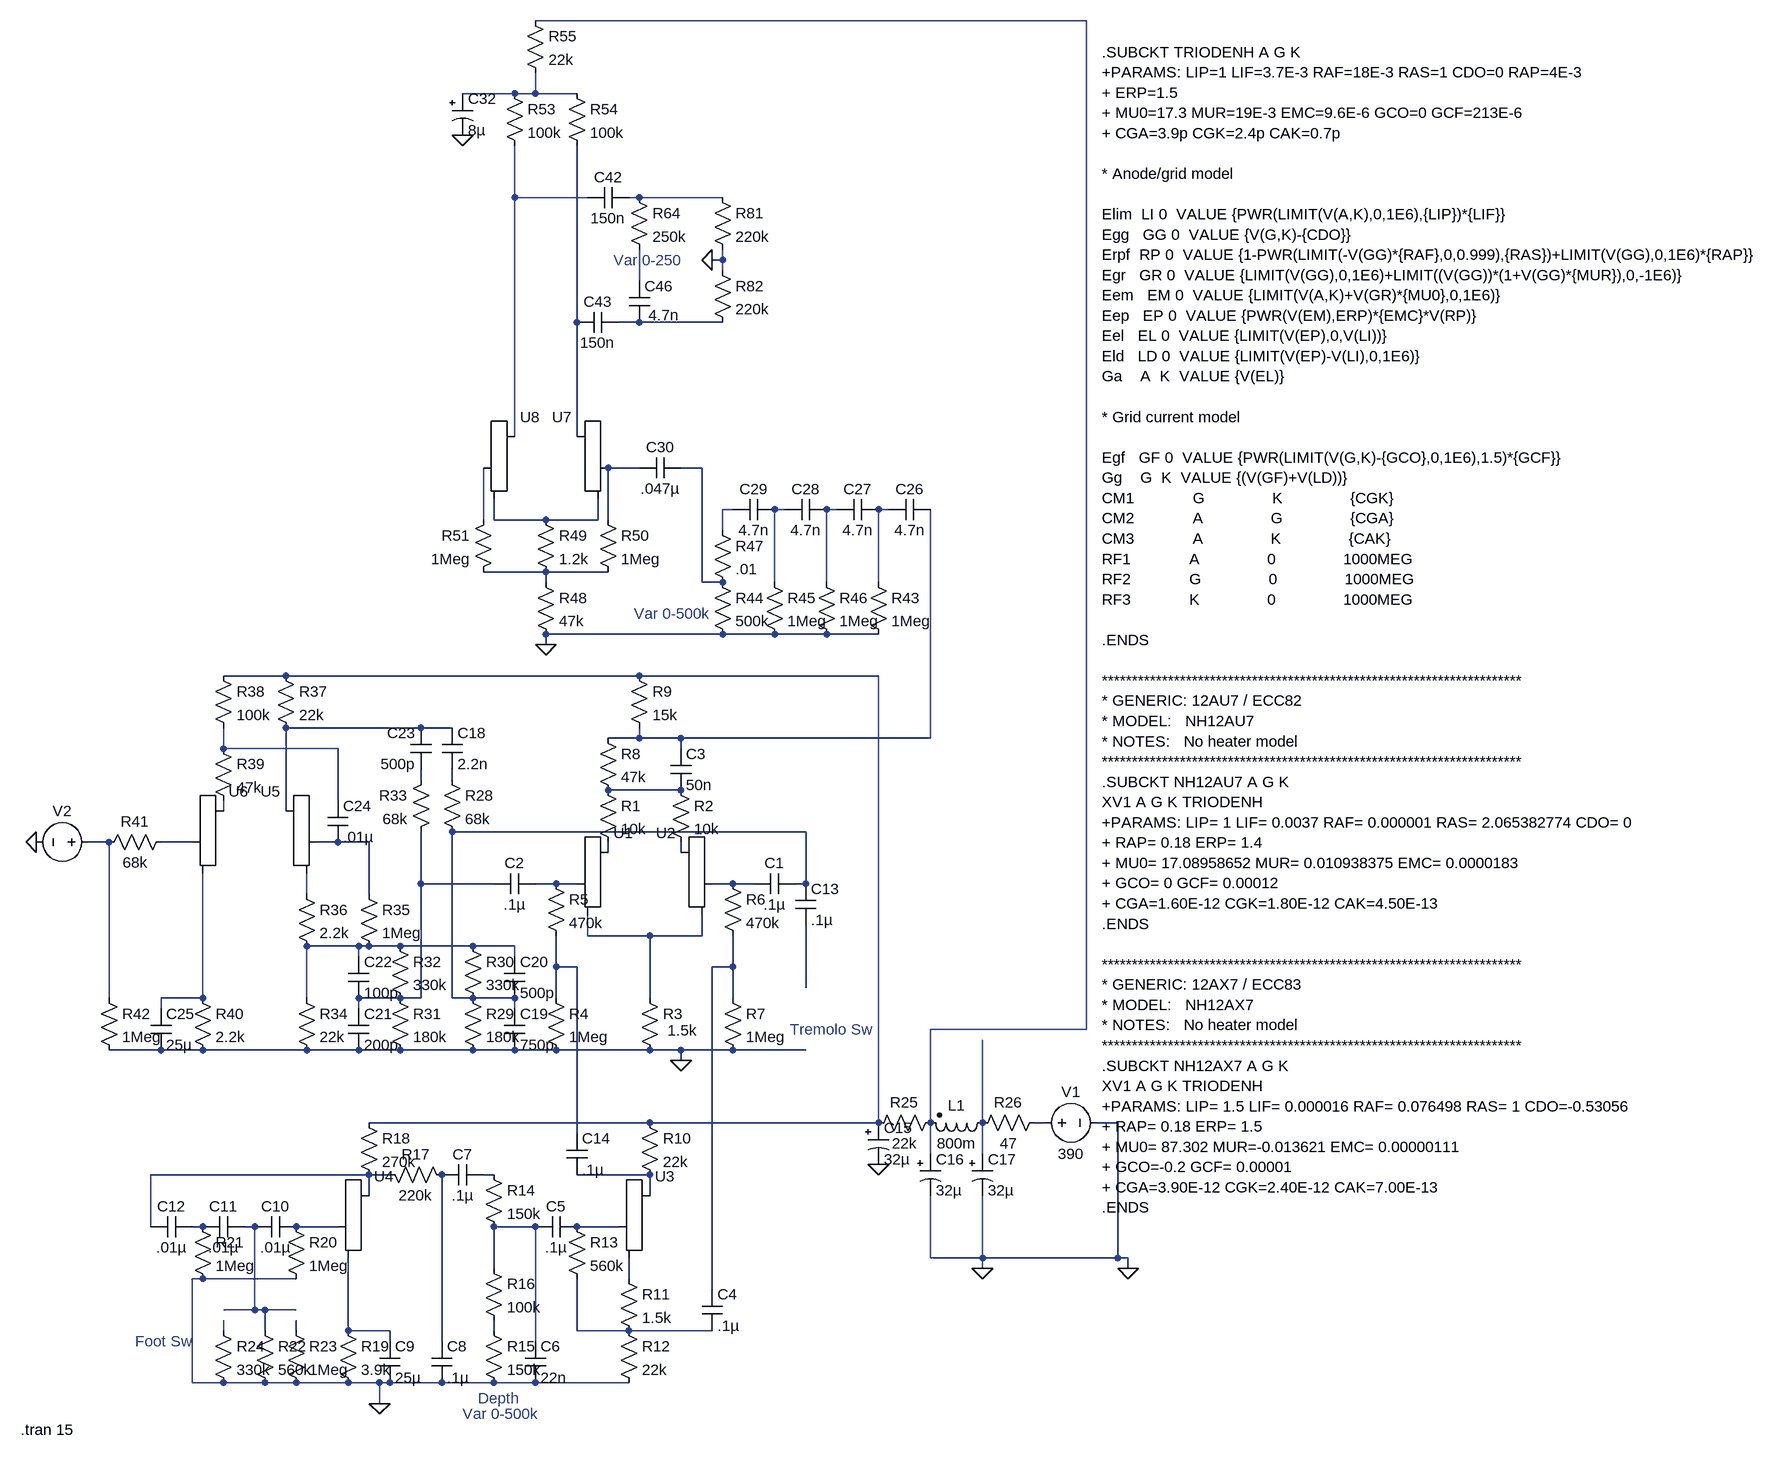
[diagram p0: schematic partial.asc]
partial.asc, the LTspice schematic file:
Version 4
SHEET 1 3184 12068
WIRE 912 -1440 64 -1440
WIRE 32 -1328 -48 -1328
WIRE 64 -1328 64 -1360
WIRE 64 -1328 32 -1328
WIRE 128 -1328 64 -1328
WIRE 32 -1168 32 -1248
WIRE 144 -1168 32 -1168
WIRE 224 -1168 208 -1168
WIRE 352 -1168 224 -1168
WIRE 352 -1072 352 -1088
WIRE 352 -1072 336 -1072
WIRE 352 -1056 352 -1072
WIRE 224 -1040 224 -1088
WIRE 128 -976 128 -1248
WIRE 224 -976 192 -976
WIRE 352 -976 224 -976
WIRE 32 -800 32 -1168
WIRE 128 -800 128 -976
WIRE 224 -752 176 -752
WIRE 320 -752 288 -752
WIRE 368 -688 352 -688
WIRE 448 -688 432 -688
WIRE 528 -688 512 -688
WIRE 608 -688 592 -688
WIRE -16 -672 -16 -752
WIRE 0 -672 0 -704
WIRE 80 -672 0 -672
WIRE 160 -672 160 -704
WIRE 160 -672 80 -672
WIRE 176 -672 176 -752
WIRE 352 -656 352 -688
WIRE 80 -592 -16 -592
WIRE 176 -592 80 -592
WIRE 80 -576 80 -592
WIRE 320 -576 320 -752
WIRE 352 -576 320 -576
WIRE 432 -576 432 -688
WIRE 512 -576 512 -688
WIRE 592 -576 592 -688
WIRE 352 -496 80 -496
WIRE 432 -496 352 -496
WIRE 512 -496 432 -496
WIRE 592 -496 512 -496
WIRE 80 -480 80 -496
WIRE -320 -432 -416 -432
WIRE 224 -432 -320 -432
WIRE 592 -432 224 -432
WIRE -112 -352 -320 -352
WIRE -64 -352 -112 -352
WIRE 224 -336 224 -352
WIRE 224 -336 176 -336
WIRE 288 -336 224 -336
WIRE 672 -336 672 -688
WIRE 672 -336 288 -336
WIRE -416 -320 -416 -352
WIRE -240 -320 -416 -320
WIRE 288 -320 288 -336
WIRE -112 -272 -112 -288
WIRE -64 -272 -64 -288
WIRE 288 -256 176 -256
WIRE -240 -240 -240 -320
WIRE -416 -224 -416 -240
WIRE -320 -224 -320 -352
WIRE 480 -192 -64 -192
WIRE -592 -176 -624 -176
WIRE -464 -176 -512 -176
WIRE -240 -176 -272 -176
WIRE -192 -176 -240 -176
WIRE 176 -160 176 -176
WIRE 288 -160 288 -176
WIRE -112 -112 -112 -192
WIRE 0 -112 -112 -112
WIRE 96 -112 64 -112
WIRE 128 -112 96 -112
WIRE 368 -112 336 -112
WIRE 400 -112 368 -112
WIRE 480 -112 480 -192
WIRE 480 -112 464 -112
WIRE -288 -96 -288 -128
WIRE -192 -96 -192 -176
WIRE 144 -32 144 -64
WIRE 240 -32 144 -32
WIRE 320 -32 320 -64
WIRE 320 -32 240 -32
WIRE -208 -16 -288 -16
WIRE -192 -16 -208 -16
WIRE -144 -16 -192 -16
WIRE -32 -16 -144 -16
WIRE 32 -16 -32 -16
WIRE -208 0 -208 -16
WIRE 32 0 32 -16
WIRE 96 16 96 -32
WIRE 128 16 96 16
WIRE 368 16 368 -32
WIRE 368 16 336 16
WIRE 480 48 480 -48
WIRE -592 64 -592 -176
WIRE -448 64 -448 -128
WIRE -448 64 -512 64
WIRE -288 64 -288 -16
WIRE -144 64 -208 64
WIRE -112 64 -112 -112
WIRE -112 64 -144 64
WIRE -64 64 -64 -192
WIRE -32 64 -64 64
WIRE 32 64 -32 64
WIRE 96 64 96 16
WIRE 240 64 240 -32
WIRE 368 64 368 16
WIRE -512 80 -512 64
WIRE -208 80 -208 64
WIRE 32 80 32 64
WIRE 912 112 912 -1440
WIRE 912 112 672 112
WIRE -512 144 -592 144
WIRE -448 144 -512 144
WIRE -288 144 -448 144
WIRE -208 144 -288 144
WIRE -144 144 -208 144
WIRE -32 144 -144 144
WIRE 32 144 -32 144
WIRE 96 144 32 144
WIRE 240 144 96 144
WIRE 288 144 240 144
WIRE 368 144 288 144
WIRE 480 144 368 144
WIRE 288 160 288 144
WIRE 240 256 -192 256
WIRE 592 256 592 -432
WIRE 592 256 240 256
WIRE 672 256 672 112
WIRE 752 256 752 128
WIRE 848 256 832 256
WIRE 960 256 928 256
WIRE 128 272 128 16
WIRE 672 304 672 256
WIRE 752 304 752 256
WIRE -192 336 -528 336
WIRE -160 336 -192 336
WIRE 0 336 -16 336
WIRE 240 336 128 336
WIRE -192 368 -192 336
WIRE 240 368 240 336
WIRE -528 416 -528 336
WIRE -448 416 -464 416
WIRE -368 416 -384 416
WIRE -240 416 -304 416
WIRE 64 416 0 416
WIRE 192 416 128 416
WIRE 672 464 672 368
WIRE 752 464 752 368
WIRE 752 464 672 464
WIRE 960 464 960 256
WIRE 960 464 752 464
WIRE 976 464 960 464
WIRE 0 480 0 416
WIRE 752 480 752 464
WIRE 976 480 976 464
WIRE -448 496 -464 496
WIRE -304 496 -448 496
WIRE 208 496 208 464
WIRE 336 512 336 16
WIRE -368 544 -368 416
WIRE -368 544 -416 544
WIRE -352 544 -368 544
WIRE -304 544 -352 544
WIRE -416 576 -416 560
WIRE -352 576 -352 544
WIRE -304 576 -304 560
WIRE -224 576 -224 464
WIRE -160 576 -224 576
WIRE 0 576 0 560
WIRE 128 576 128 496
WIRE 208 576 128 576
WIRE 336 576 208 576
WIRE -160 592 -160 576
WIRE -80 592 -80 336
WIRE 64 592 64 416
WIRE -464 656 -464 496
WIRE -416 656 -464 656
WIRE -352 656 -416 656
WIRE -304 656 -352 656
WIRE -224 656 -304 656
WIRE -176 656 -224 656
WIRE -160 656 -176 656
WIRE -80 656 -160 656
WIRE 0 656 -80 656
WIRE 64 656 0 656
WIRE 208 656 64 656
WIRE -176 688 -176 656
FLAG -176 688 0
FLAG 288 160 0
FLAG 592 320 0
FLAG 752 480 0
FLAG -704 -176 0
FLAG 80 -480 0
FLAG -48 -1264 0
FLAG 336 -1072 0
FLAG 976 480 0
SYMBOL Misc\\triode 176 -112 R0
WINDOW 3 23 58 Left 0
SYMATTR Value ""
SYMATTR InstName U1
SYMATTR SpiceModel NH12AU7
SYMBOL Misc\\triode 288 -112 M0
WINDOW 3 -24 64 Invisible 0
SYMATTR Value ""
SYMATTR InstName U2
SYMATTR SpiceModel NH12AU7
SYMBOL res 224 48 R0
WINDOW 3 43 66 Left 0
SYMATTR Value 1.5k
SYMATTR InstName R3
SYMBOL cap 400 -96 R270
WINDOW 0 32 32 VTop 0
WINDOW 3 0 32 VBottom 0
SYMATTR InstName C1
SYMATTR Value .1µ
SYMBOL cap 0 -96 R270
WINDOW 0 32 32 VTop 0
WINDOW 3 0 32 VBottom 0
SYMATTR InstName C2
SYMATTR Value .1µ
SYMBOL res 80 48 R0
SYMATTR InstName R4
SYMATTR Value 1Meg
SYMBOL res 80 -128 R0
SYMATTR InstName R5
SYMATTR Value 470k
SYMBOL res 352 -128 R0
SYMATTR InstName R6
SYMATTR Value 470k
SYMBOL res 352 48 R0
SYMATTR InstName R7
SYMATTR Value 1Meg
SYMBOL res 160 -272 R0
SYMATTR InstName R1
SYMATTR Value 10k
SYMBOL res 272 -272 R0
SYMATTR InstName R2
SYMATTR Value 10k
SYMBOL res 160 -352 R0
SYMATTR InstName R8
SYMATTR Value 47k
SYMBOL cap 272 -320 R0
SYMATTR InstName C3
SYMATTR Value 50n
SYMBOL res 208 -448 R0
SYMATTR InstName R9
SYMATTR Value 15k
SYMBOL res 224 240 R0
SYMATTR InstName R10
SYMATTR Value 22k
SYMBOL Misc\\triode 240 416 R0
WINDOW 3 -24 64 Invisible 0
SYMATTR Value ""
SYMATTR InstName U3
SYMATTR SpiceModel NH12AX7
SYMBOL res 192 480 R0
SYMATTR InstName R11
SYMATTR Value 1.5k
SYMBOL res 192 560 R0
SYMATTR InstName R12
SYMATTR Value 22k
SYMBOL cap 320 512 R0
SYMATTR InstName C4
SYMATTR Value .1µ
SYMBOL res 112 400 R0
SYMATTR InstName R13
SYMATTR Value 560k
SYMBOL cap 128 432 M270
WINDOW 0 32 32 VTop 0
WINDOW 3 0 32 VBottom 0
SYMATTR InstName C5
SYMATTR Value .1µ
SYMBOL cap 48 592 R0
SYMATTR InstName C6
SYMATTR Value 22n
SYMBOL res -16 320 R0
SYMATTR InstName R14
SYMATTR Value 150k
SYMBOL res -16 560 R0
SYMATTR InstName R15
SYMATTR Value 150k
SYMBOL res -16 464 R0
SYMATTR InstName R16
SYMATTR Value 100k
SYMBOL cap -16 352 M270
WINDOW 0 32 32 VTop 0
WINDOW 3 0 32 VBottom 0
SYMATTR InstName C7
SYMATTR Value .1µ
SYMBOL cap -96 592 R0
SYMATTR InstName C8
SYMATTR Value .1µ
SYMBOL res -64 352 M270
WINDOW 0 32 56 VTop 0
WINDOW 3 0 56 VBottom 0
SYMATTR InstName R17
SYMATTR Value 220k
SYMBOL Misc\\triode -192 416 R0
WINDOW 3 -10 61 Invisible 0
SYMATTR Value ""
SYMATTR InstName U4
SYMATTR SpiceModel NH12AX7
SYMBOL res -208 240 R0
SYMATTR InstName R18
SYMATTR Value 270k
SYMBOL res -240 560 R0
SYMATTR InstName R19
SYMATTR Value 3.9k
SYMBOL cap -176 592 R0
SYMATTR InstName C9
SYMATTR Value 25µ
SYMATTR SpiceLine V=25
SYMBOL res -320 400 R0
SYMATTR InstName R20
SYMATTR Value 1Meg
SYMBOL cap -368 432 R270
WINDOW 0 32 32 VTop 0
WINDOW 3 0 32 VBottom 0
SYMATTR InstName C10
SYMATTR Value .01µ
SYMBOL cap -448 432 R270
WINDOW 0 32 32 VTop 0
WINDOW 3 0 32 VBottom 0
SYMATTR InstName C11
SYMATTR Value .01µ
SYMBOL cap -528 432 R270
WINDOW 0 32 32 VTop 0
WINDOW 3 0 32 VBottom 0
SYMATTR InstName C12
SYMATTR Value .01µ
SYMBOL res -464 400 R0
SYMATTR InstName R21
SYMATTR Value 1Meg
SYMBOL res -368 560 R0
SYMATTR InstName R22
SYMATTR Value 560k
SYMBOL res -320 560 R0
SYMATTR InstName R23
SYMATTR Value 1Meg
SYMBOL res -432 560 R0
SYMATTR InstName R24
SYMATTR Value 330k
SYMBOL cap 464 -112 R0
SYMATTR InstName C13
SYMATTR Value .1µ
SYMBOL cap 112 272 R0
SYMATTR InstName C14
SYMATTR Value .1µ
SYMBOL polcap 576 256 R0
SYMATTR InstName C15
SYMATTR Value 32µ
SYMBOL res 576 272 R270
WINDOW 0 32 56 VTop 0
WINDOW 3 0 56 VBottom 0
SYMATTR InstName R25
SYMATTR Value 22k
SYMBOL ind2 768 240 R90
WINDOW 0 5 56 VBottom 0
WINDOW 3 32 56 VTop 0
SYMATTR InstName L1
SYMATTR Value 800m
SYMATTR Type ind
SYMATTR SpiceLine Ipk=100
SYMBOL polcap 656 304 R0
SYMATTR InstName C16
SYMATTR Value 32µ
SYMATTR SpiceLine V=450
SYMBOL polcap 736 304 R0
SYMATTR InstName C17
SYMATTR Value 32µ
SYMATTR SpiceLine V=450
SYMBOL res 848 240 R90
WINDOW 0 0 56 VBottom 0
WINDOW 3 32 56 VTop 0
SYMATTR InstName R26
SYMATTR Value 47
SYMBOL res -80 -288 R0
SYMATTR InstName R28
SYMATTR Value 68k
SYMBOL cap -80 -352 R0
SYMATTR InstName C18
SYMATTR Value 2.2n
SYMBOL cap 16 80 R0
SYMATTR InstName C19
SYMATTR Value 750p
SYMBOL res -48 48 R0
SYMATTR InstName R29
SYMATTR Value 180k
SYMBOL cap 16 0 R0
SYMATTR InstName C20
SYMATTR Value 500p
SYMBOL res -48 -32 R0
SYMATTR InstName R30
SYMATTR Value 330k
SYMBOL res -160 48 R0
SYMATTR InstName R31
SYMATTR Value 180k
SYMBOL res -160 -32 R0
SYMATTR InstName R32
SYMATTR Value 330k
SYMBOL cap -224 80 R0
SYMATTR InstName C21
SYMATTR Value 200p
SYMBOL cap -224 0 R0
SYMATTR InstName C22
SYMATTR Value 100p
SYMBOL res -96 -288 M0
SYMATTR InstName R33
SYMATTR Value 68k
SYMBOL cap -96 -352 M0
SYMATTR InstName C23
SYMATTR Value 500p
SYMBOL res -304 48 R0
SYMATTR InstName R34
SYMATTR Value 22k
SYMBOL res -208 -112 R0
SYMATTR InstName R35
SYMATTR Value 1Meg
SYMBOL Misc\\triode -320 -176 M0
WINDOW 3 -24 64 Invisible 0
SYMATTR Value ""
SYMATTR InstName U5
SYMATTR SpiceModel NH12AX7
SYMBOL res -304 -112 R0
SYMATTR InstName R36
SYMATTR Value 2.2k
SYMBOL cap -256 -240 R0
SYMATTR InstName C24
SYMATTR Value .01µ
SYMBOL res -336 -448 R0
SYMATTR InstName R37
SYMATTR Value 22k
SYMBOL Misc\\triode -416 -176 R0
WINDOW 3 -24 64 Invisible 0
SYMATTR Value ""
SYMATTR InstName U6
SYMATTR SpiceModel NH12AX7
SYMBOL res -432 -448 R0
SYMATTR InstName R38
SYMATTR Value 100k
SYMBOL res -432 -336 R0
SYMATTR InstName R39
SYMATTR Value 47k
SYMBOL res -464 48 R0
SYMATTR InstName R40
SYMATTR Value 2.2k
SYMBOL cap -528 80 R0
SYMATTR InstName C25
SYMATTR Value 25µ
SYMATTR SpiceLine V=25
SYMBOL res -496 -192 R90
WINDOW 0 0 56 VBottom 0
WINDOW 3 32 56 VTop 0
SYMATTR InstName R41
SYMATTR Value 68k
SYMBOL res -608 48 R0
SYMATTR InstName R42
SYMATTR Value 1Meg
SYMBOL voltage -608 -176 R90
WINDOW 0 -32 56 VBottom 0
WINDOW 3 32 56 Invisible 0
WINDOW 39 0 0 Left 0
SYMATTR InstName V2
SYMATTR Value SINE(0 .15 300)
SYMATTR Value2 AC 1
SYMBOL res 576 -592 R0
SYMATTR InstName R43
SYMATTR Value 1Meg
SYMBOL cap 672 -672 M270
WINDOW 0 32 32 VTop 0
WINDOW 3 0 32 VBottom 0
SYMATTR InstName C26
SYMATTR Value 4.7n
SYMBOL cap 592 -672 M270
WINDOW 0 32 32 VTop 0
WINDOW 3 0 32 VBottom 0
SYMATTR InstName C27
SYMATTR Value 4.7n
SYMBOL cap 512 -672 M270
WINDOW 0 32 32 VTop 0
WINDOW 3 0 32 VBottom 0
SYMATTR InstName C28
SYMATTR Value 4.7n
SYMBOL cap 432 -672 M270
WINDOW 0 32 32 VTop 0
WINDOW 3 0 32 VBottom 0
SYMATTR InstName C29
SYMATTR Value 4.7n
SYMBOL res 336 -592 R0
SYMATTR InstName R44
SYMATTR Value 500k
SYMBOL res 416 -592 R0
SYMATTR InstName R45
SYMATTR Value 1Meg
SYMBOL res 496 -592 R0
SYMATTR InstName R46
SYMATTR Value 1Meg
SYMBOL res 336 -672 R0
SYMATTR InstName R47
SYMATTR Value .01
SYMBOL res 64 -592 R0
SYMATTR InstName R48
SYMATTR Value 47k
SYMBOL res 64 -688 R0
SYMATTR InstName R49
SYMATTR Value 1.2k
SYMBOL res 160 -688 R0
SYMATTR InstName R50
SYMATTR Value 1Meg
SYMBOL res 0 -688 M0
SYMATTR InstName R51
SYMATTR Value 1Meg
SYMBOL Misc\\triode 128 -752 M0
WINDOW 3 -24 64 Invisible 0
SYMATTR Value ""
SYMATTR InstName U7
SYMATTR SpiceModel NH12AX7
SYMBOL Misc\\triode 32 -752 R0
WINDOW 3 -24 64 Invisible 0
SYMATTR Value ""
SYMATTR InstName U8
SYMATTR SpiceModel NH12AX7
SYMBOL cap 288 -768 R90
WINDOW 0 0 32 VBottom 0
WINDOW 3 32 32 VTop 0
SYMATTR InstName C30
SYMATTR Value .047µ
SYMBOL res 16 -1344 R0
SYMATTR InstName R53
SYMATTR Value 100k
SYMBOL res 112 -1344 R0
SYMATTR InstName R54
SYMATTR Value 100k
SYMBOL polcap -64 -1328 R0
SYMATTR InstName C32
SYMATTR Value 8µ
SYMBOL res 48 -1456 R0
SYMATTR InstName R55
SYMATTR Value 22k
SYMBOL cap 208 -1184 R90
WINDOW 0 0 32 VBottom 0
WINDOW 3 32 32 VTop 0
SYMATTR InstName C42
SYMATTR Value 150n
SYMBOL cap 192 -992 R90
WINDOW 0 0 32 VBottom 0
WINDOW 3 32 32 VTop 0
SYMATTR InstName C43
SYMATTR Value 150n
SYMBOL res 208 -1184 R0
SYMATTR InstName R64
SYMATTR Value 250k
SYMBOL cap 208 -1040 R0
WINDOW 3 30 53 Left 0
SYMATTR Value 4.7n
SYMATTR InstName C46
SYMBOL res 336 -1184 R0
SYMATTR InstName R81
SYMATTR Value 220k
SYMBOL res 336 -1072 R0
SYMATTR InstName R82
SYMATTR Value 220k
SYMBOL voltage 832 256 R270
WINDOW 0 32 56 VTop 0
WINDOW 3 -32 56 VBottom 0
WINDOW 123 0 0 Left 0
WINDOW 39 0 0 Left 0
SYMATTR InstName V1
SYMATTR Value 390
TEXT -48 704 Left 0 ;Var 0-500k
TEXT -24 680 Left 0 ;Depth
TEXT -552 592 Left 0 ;Foot Sw
TEXT 456 112 Left 0 ;Tremolo Sw
TEXT 216 -528 Left 0 ;Var 0-500k
TEXT 184 -1072 Left 0 ;Var 0-250
TEXT 936 -1392 Left 0 !.SUBCKT TRIODENH A G K\n+PARAMS: LIP=1 LIF=3.7E-3 RAF=18E-3 RAS=1 CDO=0 RAP=4E-3\n+ ERP=1.5\n+ MU0=17.3 MUR=19E-3 EMC=9.6E-6 GCO=0 GCF=213E-6\n+ CGA=3.9p CGK=2.4p CAK=0.7p \n \n* Anode/grid model\n \nElim  LI 0  VALUE {PWR(LIMIT(V(A,K),0,1E6),{LIP})*{LIF}}\nEgg   GG 0  VALUE {V(G,K)-{CDO}}\nErpf  RP 0  VALUE {1-PWR(LIMIT(-V(GG)*{RAF},0,0.999),{RAS})+LIMIT(V(GG),0,1E6)*{RAP}}\nEgr   GR 0  VALUE {LIMIT(V(GG),0,1E6)+LIMIT((V(GG))*(1+V(GG)*{MUR}),0,-1E6)}\nEem   EM 0  VALUE {LIMIT(V(A,K)+V(GR)*{MU0},0,1E6)}\nEep   EP 0  VALUE {PWR(V(EM),ERP)*{EMC}*V(RP)}\nEel   EL 0  VALUE {LIMIT(V(EP),0,V(LI))}\nEld   LD 0  VALUE {LIMIT(V(EP)-V(LI),0,1E6)}\nGa    A  K  VALUE {V(EL)}\n \n* Grid current model\n \nEgf   GF 0  VALUE {PWR(LIMIT(V(G,K)-{GCO},0,1E6),1.5)*{GCF}}\nGg    G  K  VALUE {(V(GF)+V(LD))}\nCM1             G               K               {CGK}\nCM2             A               G               {CGA}\nCM3             A               K               {CAK}\nRF1             A               0               1000MEG\nRF2             G               0               1000MEG\nRF3             K               0               1000MEG\n \n.ENDS\n \n**********************************************************************\n* GENERIC: 12AU7 / ECC82\n* MODEL:   NH12AU7\n* NOTES:   No heater model\n**********************************************************************\n.SUBCKT NH12AU7 A G K\nXV1 A G K TRIODENH\n+PARAMS: LIP= 1 LIF= 0.0037 RAF= 0.000001 RAS= 2.065382774 CDO= 0 \n+ RAP= 0.18 ERP= 1.4 \n+ MU0= 17.08958652 MUR= 0.010938375 EMC= 0.0000183 \n+ GCO= 0 GCF= 0.00012 \n+ CGA=1.60E-12 CGK=1.80E-12 CAK=4.50E-13\n.ENDS\n \n**********************************************************************\n* GENERIC: 12AX7 / ECC83\n* MODEL:   NH12AX7\n* NOTES:   No heater model\n**********************************************************************\n.SUBCKT NH12AX7 A G K\nXV1 A G K TRIODENH\n+PARAMS: LIP= 1.5 LIF= 0.000016 RAF= 0.076498 RAS= 1 CDO=-0.53056 \n+ RAP= 0.18 ERP= 1.5 \n+ MU0= 87.302 MUR=-0.013621 EMC= 0.00000111 \n+ GCO=-0.2 GCF= 0.00001 \n+ CGA=3.90E-12 CGK=2.40E-12 CAK=7.00E-13\n.ENDS
TEXT -728 728 Left 0 !.tran 15

The netlist it stands for:
* partial.asc
XU1 N029 N032 N035 NH12AU7
XU2 N030 N033 N035 NH12AU7
R3 N035 0 1.5k
C1 N033 N025 .1µ
C2 N031 N032 .1µ
R4 N037 0 1Meg
R5 N032 N037 470k
R6 N033 N038 470k
R7 N038 0 1Meg
R1 N023 N029 10k
R2 N023 N030 10k
R8 N019 N023 47k
C3 N019 N023 50n
R9 N017 N019 15k
R10 N017 N045 22k
XU3 N045 N050 N051 NH12AX7
R11 N051 N056 1.5k
R12 N056 0 22k
C4 N038 N056 .1µ
R13 N050 N056 560k
C5 N050 N049 .1µ
C6 N049 0 22n
R14 N044 N049 150k
R15 N055 0 150k
R16 N049 N055 100k
C7 N044 N057 .1µ
C8 N057 0 .1µ
R17 N057 N043 220k
XU4 N043 N048 N054 NH12AX7
R18 N017 N043 270k
R19 N054 0 3.9k
C9 N054 0 25µ V=25
R20 N048 0 1Meg
C10 N047 N048 .01µ
C11 N046 N047 .01µ
C12 N043 N046 .01µ
R21 N046 0 1Meg
R22 N047 0 560k
R23 N053 0 1Meg
R24 N052 0 330k
C13 N025 N039 .1µ
C14 N037 N045 .1µ
C15 N017 0 32µ
R25 N017 N001 22k
L1 N041 N001 800m Ipk=100
C16 N001 0 32µ V=450
C17 N041 0 32µ V=450
R26 N042 N041 47
R28 N022 N025 68k
C18 N018 N022 2.2n
C19 N025 0 750p
R29 N025 0 180k
C20 N036 N025 500p
R30 N036 N025 330k
R31 N031 0 180k
R32 N036 N031 330k
C21 N031 0 200p
C22 N036 N031 100p
R33 N021 N031 68k
C23 N018 N021 500p
R34 N036 0 22k
R35 N028 N036 1Meg
XU5 N018 N028 N034 NH12AX7
R36 N034 N036 2.2k
C24 N020 N028 .01µ
R37 N017 N018 22k
XU6 N024 N027 N040 NH12AX7
R38 N017 N020 100k
R39 N020 N024 47k
R40 N040 0 2.2k
C25 N040 0 25µ V=25
R41 N027 N026 68k
R42 N026 0 1Meg
V2 N026 0 SINE(0 .15 300) AC 1
R43 N013 0 1Meg
C26 N019 N013 4.7n
C27 N013 N012 4.7n
C28 N012 N011 4.7n
C29 N011 N010 4.7n
R44 N009 0 500k
R45 N011 0 1Meg
R46 N012 0 1Meg
R47 N010 N009 .01
R48 N016 0 47k
R49 N015 N016 1.2k
R50 N008 N016 1Meg
R51 N014 N016 1Meg
XU7 N006 N008 N015 NH12AX7
XU8 N003 N014 N015 NH12AX7
C30 N009 N008 .047µ
R53 N002 N003 100k
R54 N002 N006 100k
C32 N002 0 8µ
R55 N001 N002 22k
C42 N004 N003 150n
C43 N007 N006 150n
R64 N004 N005 250k
C46 N005 N007 4.7n
R81 N004 0 220k
R82 0 N007 220k
V1 N042 0 390
* Var 0-500k
* Depth
* Foot Sw
* Tremolo Sw
* Var 0-500k
* Var 0-250
.SUBCKT TRIODENH A G K
+PARAMS: LIP=1 LIF=3.7E-3 RAF=18E-3 RAS=1 CDO=0 RAP=4E-3
+ ERP=1.5
+ MU0=17.3 MUR=19E-3 EMC=9.6E-6 GCO=0 GCF=213E-6
+ CGA=3.9p CGK=2.4p CAK=0.7p
* Anode/grid model
Elim  LI 0  VALUE {PWR(LIMIT(V(A,K),0,1E6),{LIP})*{LIF}}
Egg   GG 0  VALUE {V(G,K)-{CDO}}
Erpf  RP 0  VALUE {1-PWR(LIMIT(-V(GG)*{RAF},0,0.999),{RAS})+LIMIT(V(GG),0,1E6)*{RAP}}
Egr   GR 0  VALUE {LIMIT(V(GG),0,1E6)+LIMIT((V(GG))*(1+V(GG)*{MUR}),0,-1E6)}
Eem   EM 0  VALUE {LIMIT(V(A,K)+V(GR)*{MU0},0,1E6)}
Eep   EP 0  VALUE {PWR(V(EM),ERP)*{EMC}*V(RP)}
Eel   EL 0  VALUE {LIMIT(V(EP),0,V(LI))}
Eld   LD 0  VALUE {LIMIT(V(EP)-V(LI),0,1E6)}
Ga    A  K  VALUE {V(EL)}
* Grid current model
Egf   GF 0  VALUE {PWR(LIMIT(V(G,K)-{GCO},0,1E6),1.5)*{GCF}}
Gg    G  K  VALUE {(V(GF)+V(LD))}
CM1             G               K               {CGK}
CM2             A               G               {CGA}
CM3             A               K               {CAK}
RF1             A               0               1000MEG
RF2             G               0               1000MEG
RF3             K               0               1000MEG
.ENDS
**********************************************************************
* GENERIC: 12AU7 / ECC82
* MODEL:   NH12AU7
* NOTES:   No heater model
**********************************************************************
.SUBCKT NH12AU7 A G K
XV1 A G K TRIODENH
+PARAMS: LIP= 1 LIF= 0.0037 RAF= 0.000001 RAS= 2.065382774 CDO= 0
+ RAP= 0.18 ERP= 1.4
+ MU0= 17.08958652 MUR= 0.010938375 EMC= 0.0000183
+ GCO= 0 GCF= 0.00012
+ CGA=1.60E-12 CGK=1.80E-12 CAK=4.50E-13
.ENDS
**********************************************************************
* GENERIC: 12AX7 / ECC83
* MODEL:   NH12AX7
* NOTES:   No heater model
**********************************************************************
.SUBCKT NH12AX7 A G K
XV1 A G K TRIODENH
+PARAMS: LIP= 1.5 LIF= 0.000016 RAF= 0.076498 RAS= 1 CDO=-0.53056
+ RAP= 0.18 ERP= 1.5
+ MU0= 87.302 MUR=-0.013621 EMC= 0.00000111
+ GCO=-0.2 GCF= 0.00001
+ CGA=3.90E-12 CGK=2.40E-12 CAK=7.00E-13
.ENDS
.tran 15
.backanno
.end